# EAGLE design meroTVsensorSide (EAGLE 6.6.0)
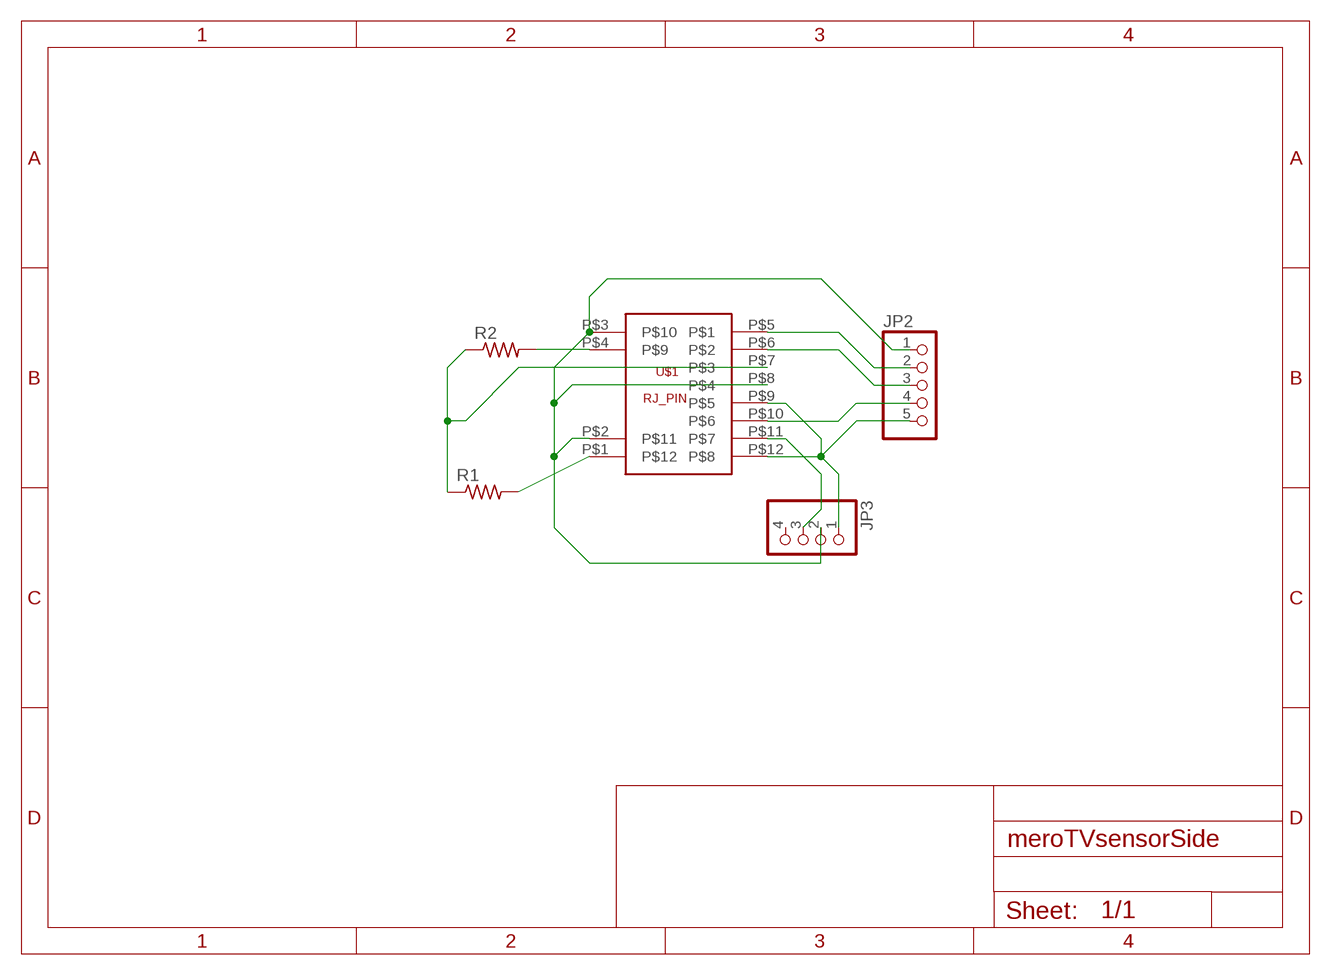
[diagram p0: schematic, sheet 1]

## Parts
JP2  PINHD-1X5  [1X05]
JP3  PINHD-1X4  [1X04]
R1  R-US_0204/7  [0204/7]
R2  R-US_0204/7  [0204/7]
U$1  RJ45_EDWRJ45-DIL  [RJ45-DIL]

## Nets
N$1: JP2.5 JP3.1 U$1.P$9 U$1.P$12
N$2: JP2.1 JP3.2 U$1.P$2 U$1.P$3 U$1.P$8
N$3: JP3.3 U$1.P$11
N$4: R1.2 U$1.P$1
N$5: R2.2 U$1.P$4
N$6: R1.1 R2.1 U$1.P$7
N$7: JP2.2 U$1.P$5
N$8: JP2.3 U$1.P$6
N$9: JP2.4 U$1.P$10
Unconnected: JP3.4

## Library data of the parts
JP2 = pinhead:PINHD-1X5: PIN HEADER
JP3 = pinhead:PINHD-1X4: PIN HEADER
R1 R2 = rcl:R-US_: RESISTOR, American symbol
U$1 = RJ45:RJ45_EDW

## Board
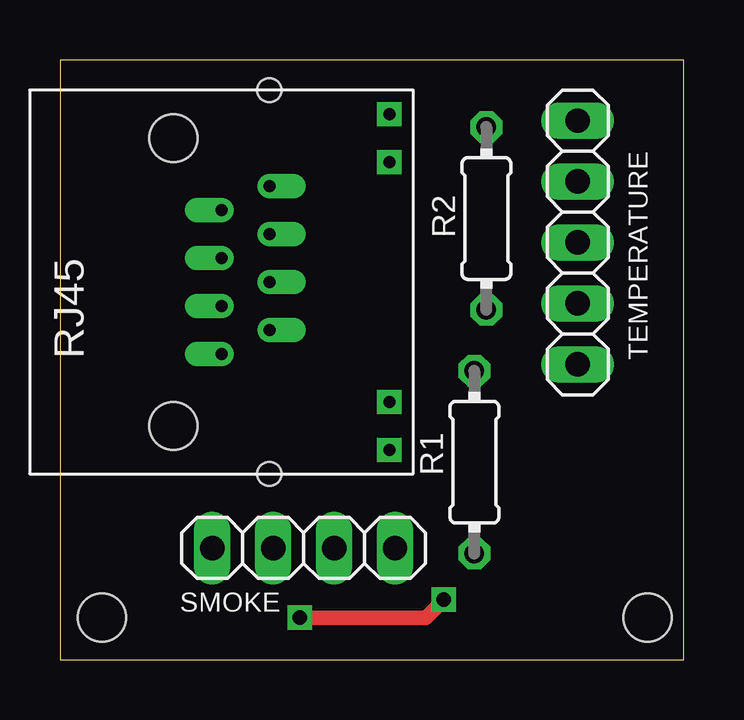
[diagram p1: board, top side]
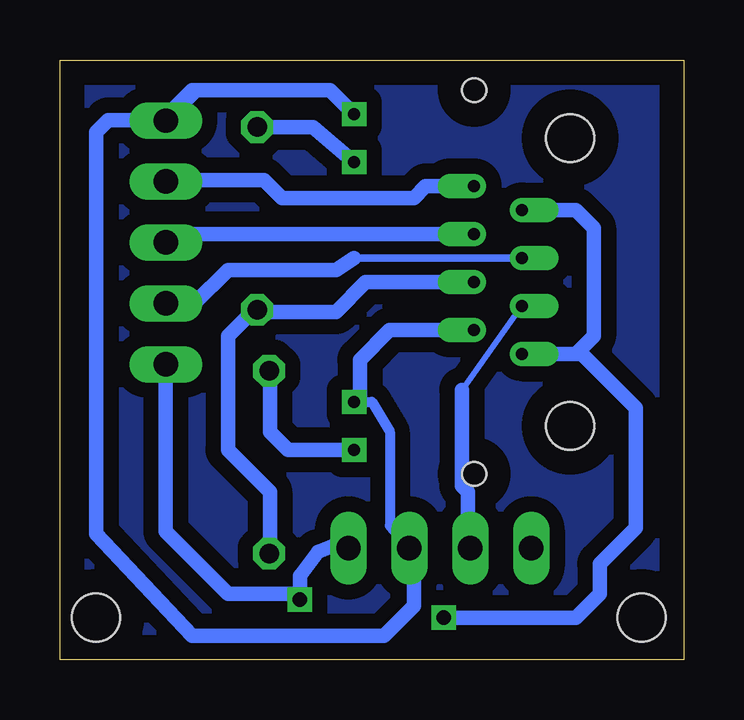
[diagram p2: board, bottom side, seen from below]

Size 26 x 25 mm. Coordinates in mm from the lower left corner, seen from the top.
Outline: 0,0 26,0 26,25 0,25 0,0
Copper layers (1*16): Top 0.035mm / dielectric 1.5mm / Bottom 0.035mm
Design rules "default *": minimum track width 10mil, minimum drill 24mil, track to track 25mil, track to pad 15mil, pad to pad 15mil, via to via 8mil, smd to smd 8mil, copper to edge 40mil, drill to drill 8mil, minimum pad ring 10mil, minimum via ring 8mil, stop-mask expansion 4mil, vias tented up to drill 0mil, thermal gap 10mil
Holes 2 mm at 1.75,1.75 24.5,1.75

### Footprints (pad centres in the part's own frame; a part is rotated, then mirrored left to right if it is on the bottom)
1X05 = drill 1.016 long: 1 -5.08,0; 2 -2.54,0; 3 0,0; 4 2.54,0; 5 5.08,0
1X04 = drill 1.016 long: 1 -3.81,0; 2 -1.27,0; 3 1.27,0; 4 3.81,0
0204/7 = drill 0.813 octagon: 1 -3.81,0; 2 3.81,0
RJ45-DIL = drill 0.5 square: P$1 15,15; P$2 13,15; P$3 1,15; P$4 3,15 | drill 0.5 pad 1.016 offset: P$5 4,10; P$6 6,10; P$7 8,10; P$8 10,10; P$9 5,8; P$10 7,8; P$11 9,8; P$12 11,8 | hole 1: 16,10; 0,10 | hole 2: 14,6; 2,6

### Placement (x,y rotation side)
JP2  21.59,17.39 270 top
JP3  10.16,4.65 180 top
R1  17.28,8.23 90 top
R2  17.78,18.39 90 top
U$1  -1.27,23.74 270 top

### Tracks (layer width: path | path; a pad name or v marks a point on that pad's centre or on a via)
GND
  pour Bottom: 26,25 0,25 0,0 26,0
N$1  (via drill 0.6)
  Top 0.61: v10,1.75 15.25,1.75 v16,2.5
  Bottom 0.61: U$1.P$9 4.49,18.74 3.75,18 3.75,13.5 4.5,12.75 U$1.P$12 4.24,12.74 2,10.5 2,5.5 3.5,4 3.5,2.75 4.5,1.75 v10,1.75 | JP3.1 14.62,4.75 15.25,4.5 16,3.5 v16,2.5 16.25,2.75 19,2.75 21.59,5.34 JP2.5
N$2
  Bottom 0.406: 20.32,23.74 14.73,23.74 | U$1.P$2 12.99,10.74 12.25,9.5 12.25,5.58 JP3.2
  Bottom 0.61: JP2.1 20.32,23.74 | 14.73,23.74 U$1.P$3 14.75,23.75 20.5,23.75 21.75,22.5 24,22.5 24.5,22 24.5,5.25 20.5,1 12.5,1 11.25,2.25 11.25,4.47 JP3.2 | U$1.P$8 12.26,13.74 13.5,12.5 13.5,10.97 U$1.P$2
N$3
  Bottom 0.254: U$1.P$11 6.76,14.74 9.25,11.25
  Bottom 0.61: 9.25,11.25 9.25,7.25 9,7 9,4.76 JP3.3
N$4
  Bottom 0.61: U$1.P$1 16.49,8.74 17.25,9.5 17.25,12.01 R1.2
N$5
  Bottom 0.61: R2.2 15.44,22.2 U$1.P$4
N$6
  Bottom 0.61: U$1.P$7 13.26,15.74 14.5,14.5 17.7,14.5 | 17.7,14.5 R2.1 | 17.7,14.5 18,14.5 19,13.5 19,8.75 17.25,7 17.25,4.45 R1.1
N$7
  Bottom 0.61: U$1.P$5 10.76,19.74 11.25,19.25 16.75,19.25 17.5,20 21.52,20 JP2.2
N$8
  Bottom 0.61: U$1.P$6 21.24,17.74 JP2.3
N$9
  Bottom 0.305: U$1.P$10 11.26,16.74 11.27,16.75 13.75,16.75
  Bottom 0.61: JP2.4 20.4,14.85 19,16.25 14.5,16.25 13.75,16.75

### Text on the board
tPlace: TEMPERATURE | SMOKE